# EasyEDA Pro project ProPrj_Trumpet_2025-12-14.epro

# Schematic Schematic1
Board Name: Board1; Create Date: 2025-12-04; Page Name: P1; Project Name: Trumpet; Schematic Name: Schematic1; Update Date: 2025-12-07; Company: EasyEDA.com; Page Size: A4; Version: V1.0
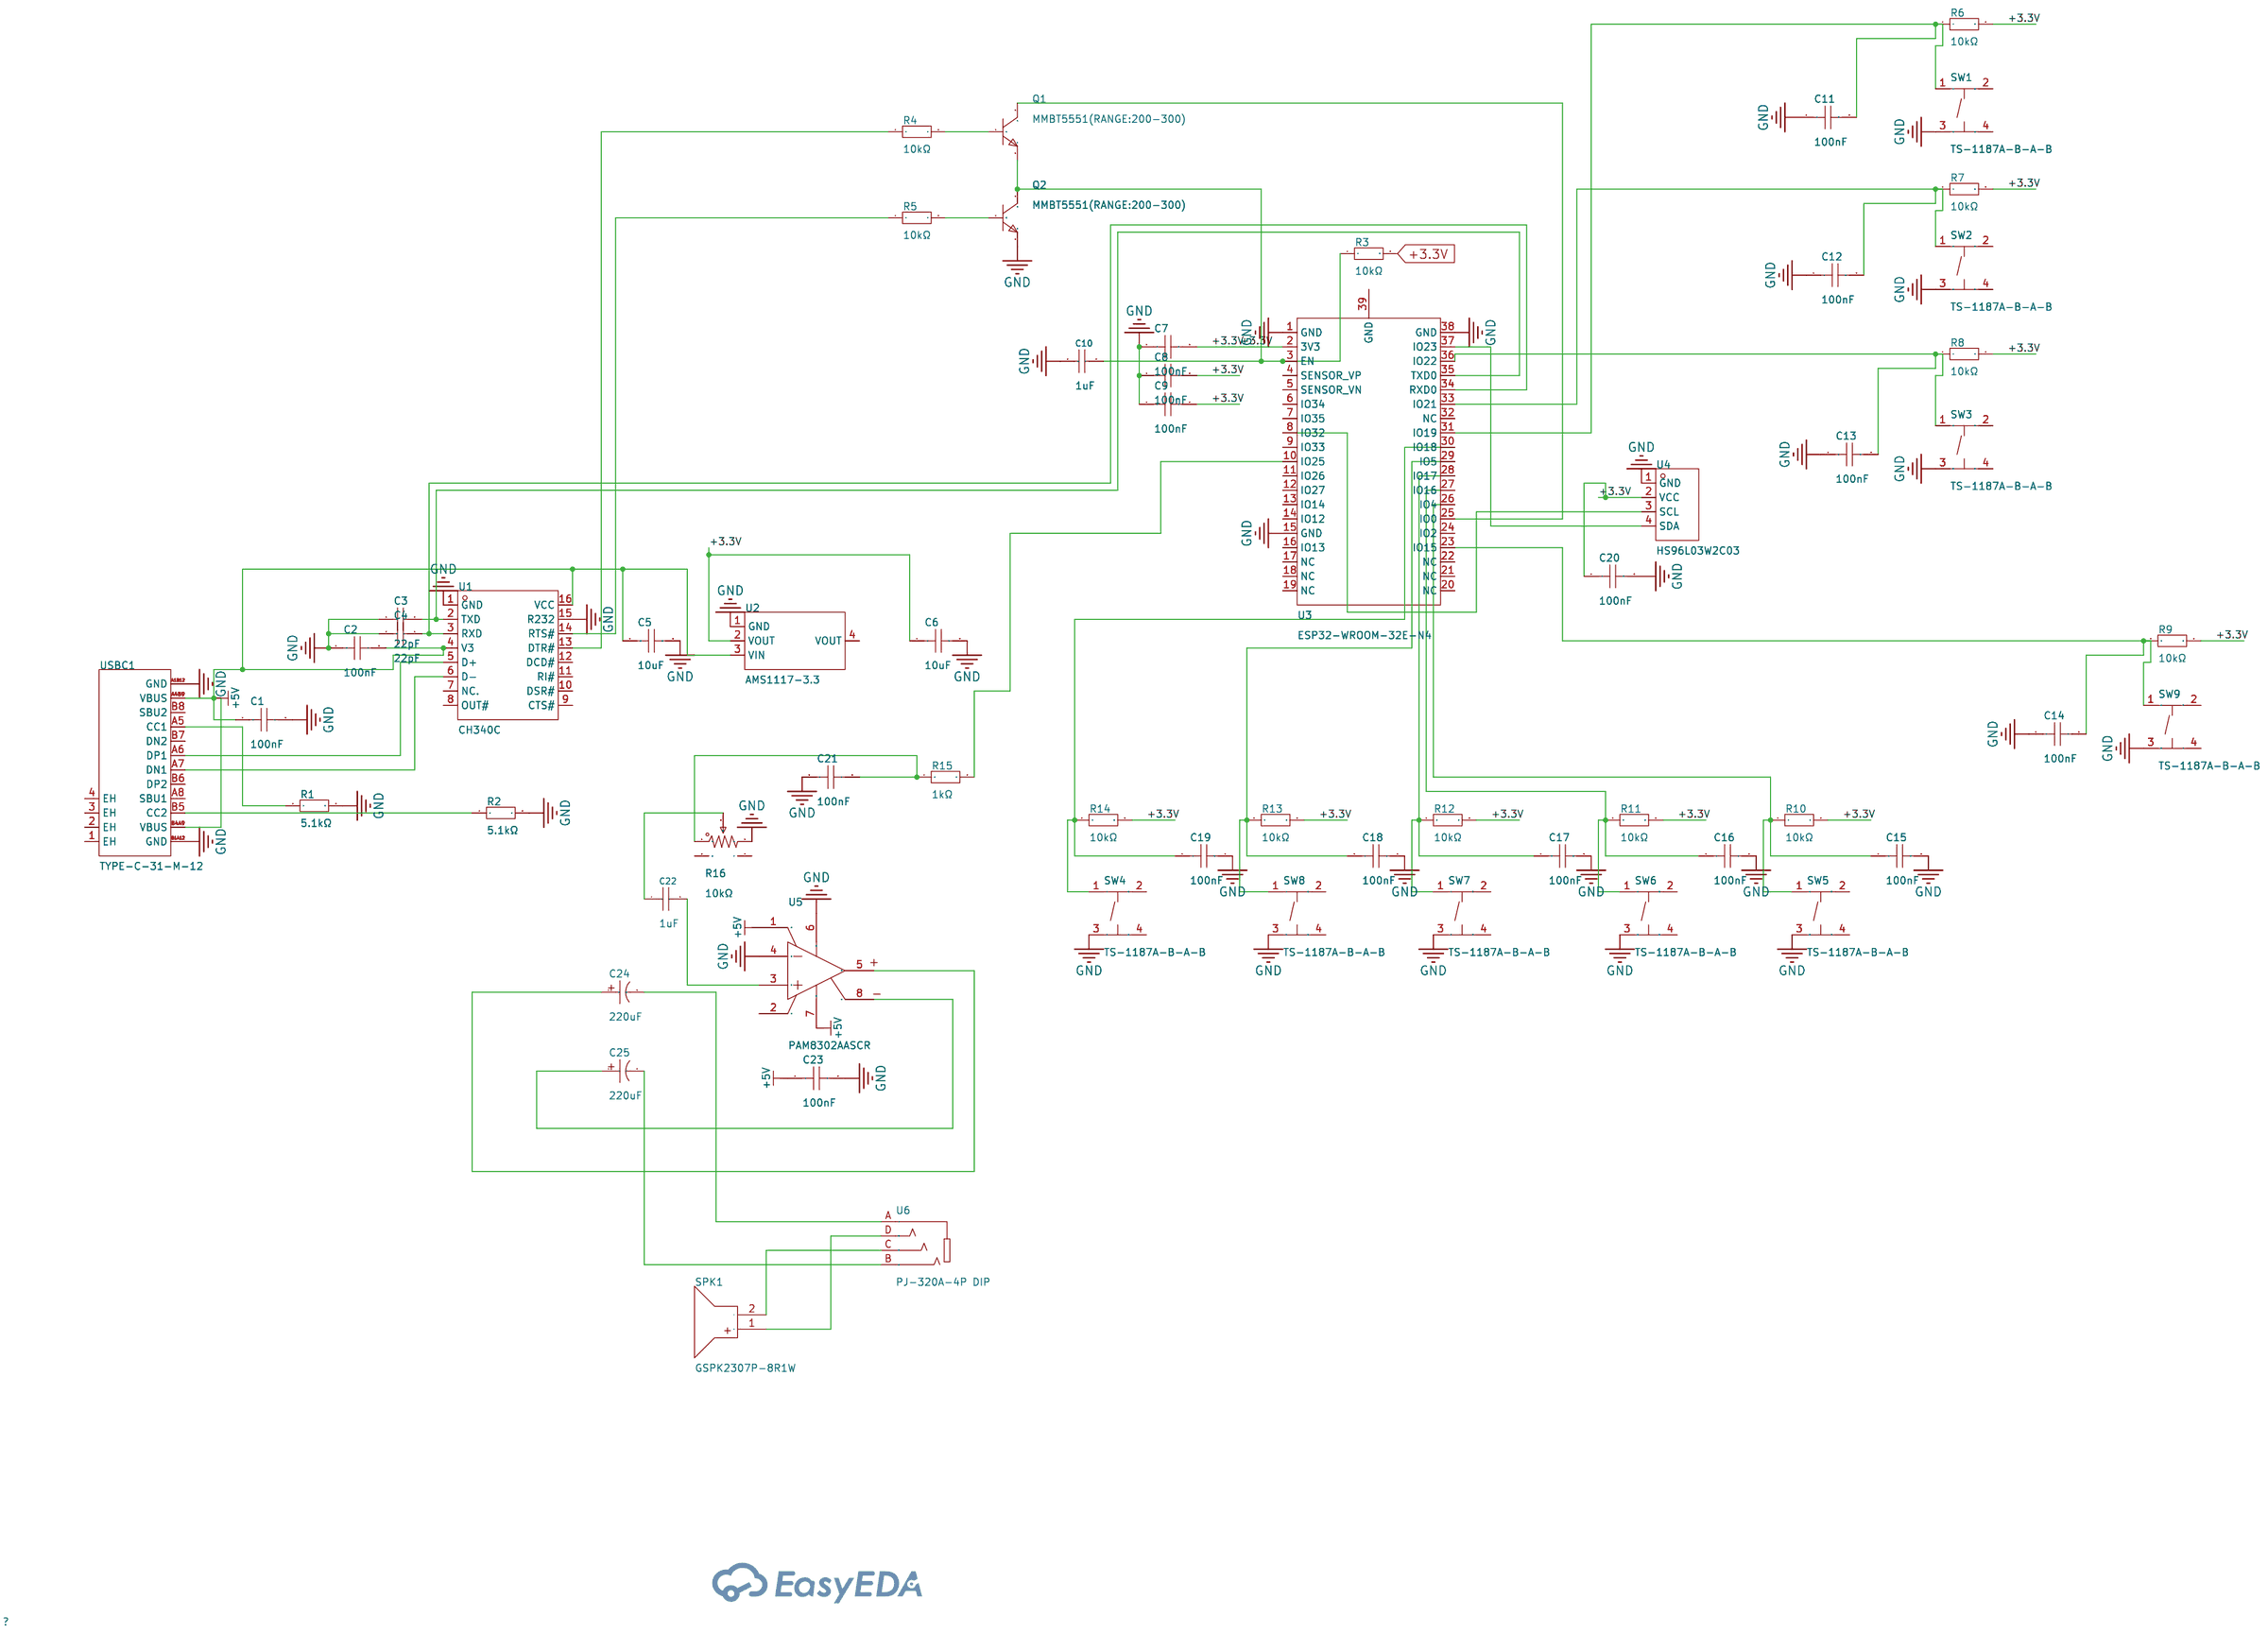
[diagram p0: schematic sheet]

## Parts
C1  100nF  [C0805]
C2  100nF  [C0805]
C3  22pF  [C0402]
C4  22pF  [C0402]
C5  10uF  [C0805]
C6  10uF  [C0805]
C7  100nF  [C0805]
C8  100nF  [C0805]
C9  100nF  [C0805]
C10  1uF  [C0805]
C11  100nF  [C0805]
C12  100nF  [C0805]
C13  100nF  [C0805]
C14  100nF  [C0805]
C15  100nF  [C0805]
C16  100nF  [C0805]
C17  100nF  [C0805]
C18  100nF  [C0805]
C19  100nF  [C0805]
C20  100nF  [C0805]
C21  100nF  [C0805]
C22  1uF  [C0805]
C23  100nF  [C0805]
C24  220uF  [CAP-TH_BD6.3-P2.50-D1.0-FD]
C25  220uF  [CAP-TH_BD6.3-P2.50-D1.0-FD]
Q1  MMBT5551(RANGE:200-300)  [SOT-23-3_L2.9-W1.3-P1.90-LS2.4-BR]
Q2  MMBT5551(RANGE:200-300)  [SOT-23-3_L2.9-W1.3-P1.90-LS2.4-BR]
R1  5.1kΩ  [R0805]
R2  5.1kΩ  [R0805]
R3  10kΩ  [R0805]
R4  10kΩ  [R0805]
R5  10kΩ  [R0805]
R6  10kΩ  [R0805]
R7  10kΩ  [R0805]
R8  10kΩ  [R0805]
R9  10kΩ  [R0805]
R10  10kΩ  [R0805]
R11  10kΩ  [R0805]
R12  10kΩ  [R0805]
R13  10kΩ  [R0805]
R14  10kΩ  [R0805]
R15  1kΩ  [R0805]
R16  10kΩ  [RES-ADJ-TH_RK09L1140A5P]
SPK1  GSPK2307P-8R1W  [SPK-TH_BD23.0-P10.00-D0.8-L-RD]
SW1  TS-1187A-B-A-B  [SW-SMD_4P-L5.1-W5.1-P3.70-LS6.5-TL_H1.5]
SW2  TS-1187A-B-A-B  [SW-SMD_4P-L5.1-W5.1-P3.70-LS6.5-TL_H1.5]
SW3  TS-1187A-B-A-B  [SW-SMD_4P-L5.1-W5.1-P3.70-LS6.5-TL_H1.5]
SW4  TS-1187A-B-A-B  [SW-SMD_4P-L5.1-W5.1-P3.70-LS6.5-TL_H1.5]
SW5  TS-1187A-B-A-B  [SW-SMD_4P-L5.1-W5.1-P3.70-LS6.5-TL_H1.5]
SW6  TS-1187A-B-A-B  [SW-SMD_4P-L5.1-W5.1-P3.70-LS6.5-TL_H1.5]
SW7  TS-1187A-B-A-B  [SW-SMD_4P-L5.1-W5.1-P3.70-LS6.5-TL_H1.5]
SW8  TS-1187A-B-A-B  [SW-SMD_4P-L5.1-W5.1-P3.70-LS6.5-TL_H1.5]
SW9  TS-1187A-B-A-B  [SW-SMD_4P-L5.1-W5.1-P3.70-LS6.5-TL_H1.5]
U1  CH340C  [SOP-16_L10.0-W3.9-P1.27-LS6.0-BL]
U2  AMS1117-3.3  [SOT-223-3_L6.5-W3.4-P2.30-LS7.0-BR]
U3  ESP32-WROOM-32E-N4  [WIFI-SMD_ESP32-WROOM-32E]
U4  HS96L03W2C03  [OLED-TH_L27.8-W27.2-P2.54_C9900033791]
U5  PAM8302AASCR  [MSOP-8_L3.0-W3.0-P0.65-LS5.0-BL]
U6  PJ-320A-4P DIP  [AUDIO-TH_PJ-320A-4P-DIP]
USBC1  TYPE-C-31-M-12  [USB-C_SMD-TYPE-C-31-M-12_1]

## Library data of the parts
C1 C2 C7-C9 C11-C21 C23 = CC0805KRX7R9BB104: Capacitance:100nF Tolerance:±10% Tolerance:±10% Voltage Rating:50V Temperature Coefficient:X7R; LCSC Part Name: 100nF ±10% 50V; Supplier Part: C49678; Manufacturer: YAGEO(国巨); Supplier Footprint: 0805; JLCPCB Part Class: Basic Part; Datasheet: https://item.szlcsc.com/datasheet/CC0805KRX7R9BB104/50686.html; Supplier: LCSC; Tolerance: ±10%; Voltage Rating: 50V; Temperature Coefficient: X7R
C3 C4 = 0402CG220J500NT: Capacitance: Tolerance:±5% Tolerance:±5% Voltage Rated: Temperature Coefficient:; LCSC Part Name: 22pF ±5% 50V; Supplier Part: C1555; Manufacturer: FH(风华); Supplier Footprint: 0402; JLCPCB Part Class: Basic Part; Datasheet: https://atta.szlcsc.com/upload/public/pdf/source/20200305/C486355_26A10D38EF8C2A5C37091D0039909270.pdf; Supplier: LCSC; Tolerance: ±5%
C5 C6 = CL21A106KAYNNNE_C15850: Capacitance:10uF Tolerance:±10% Tolerance:±10% Voltage Rating:25V Temperature Coefficient:X5R; LCSC Part Name: 10uF ±10% 25V; Supplier Part: C15850; Manufacturer: SAMSUNG(三星); Manufacturer Part: CL21A106KAYNNNE; Supplier Footprint: 0805; JLCPCB Part Class: Basic Part; Datasheet: https://item.szlcsc.com/datasheet/CL21A106KAYNNNE/16532.html; Supplier: LCSC; Tolerance: ±10%; Voltage Rating: 25V; Temperature Coefficient: X5R
C10 C22 = CL21B105KBFNNNE: Capacitance:1uF Tolerance:±10% Tolerance:±10% Voltage Rating:50V Temperature Coefficient:X7R; LCSC Part Name: 1uF ±10% 50V; Supplier Part: C28323; Manufacturer: SAMSUNG(三星); Supplier Footprint: 0805; JLCPCB Part Class: Basic Part; Datasheet: https://item.szlcsc.com/datasheet/CL21B105KBFNNNE/29074.html; Supplier: LCSC; Tolerance: ±10%; Voltage Rating: 50V; Temperature Coefficient: X7R
C24 C25 = KM227M016E11RR0VH2FP0: Capacitance:220uF Tolerance:±20% Tolerance:±20% Voltage Rating:16V Ripple Current:- Equivalent Series Resistance(ESR):- Pin Spacing:2.5mm Diameter:6.3mm Height - Seated (Max):11mm Lifetime:1000hrs@105℃; LCSC Part Name: 220uF ±20% 16V; Supplier Part: C43349; Manufacturer: Chengx(承兴); Supplier Footprint: 插件,D6.3xL11mm; JLCPCB Part Class: Extended Part; Datasheet: https://item.szlcsc.com/datasheet/KM227M016E11RR0VH2FP0/44340.html; Supplier: LCSC; Tolerance: ±20%; Voltage Rating: 16V; Pin Spacing: 2.5mm; Diameter: 6.3mm; Height - Seated (Max): 11mm; Lifetime: 1000hrs@105℃
Q1 Q2 = MMBT5551(RANGE:200-300): type:NPN Current - Collector(Ic): Collector - Emitter Voltage VCEO:160V Pd - Power Dissipation:300mW DC Current Gain:200@10mA,5V DC Current Gain:200@10mA,5V Transition frequency(fT):100MHz Current - Collector Cutoff:50nA Vce Saturation(VCE(sat)):150mV Ope; LCSC Part Name: hfe=200~300; Supplier Part: C2145; Manufacturer: CJ(江苏长电/长晶); Supplier Footprint: SOT-23; JLCPCB Part Class: Basic Part; Datasheet: https://atta.szlcsc.com/upload/public/pdf/source/20140321/1457707027001.pdf; Supplier: LCSC; type: NPN; Collector - Emitter Voltage VCEO: 160V; Pd - Power Dissipation: 300mW; DC Current Gain: 200@10mA,5V; Transition frequency(fT): 100MHz; Current - Collector Cutoff: 50nA; Vce Saturation(VCE(sat)): 150mV; Operating Temperature: -55℃~+150℃
R1 R2 = 0805W8F5101T5E: Type:Thick Film Resistor Resistance:5.1kΩ Tolerance:±1% Tolerance:±1% Power(Watts):125mW Voltage-Supply(Max):150V Temperature Coefficient:±100ppm/℃ Temperature Coefficient:±100ppm/℃ Operating Temperature:-55℃~+155℃ Operating Temperature:-55℃~+155℃; LCSC Part Name: 5.1kΩ ±1% 125mW 厚膜电阻; Supplier Part: C27834; Manufacturer: UNI-ROYAL(厚声); Supplier Footprint: 0805; JLCPCB Part Class: Basic Part; Datasheet: https://item.szlcsc.com/datasheet/0805W8F5101T5E/28584.html; Supplier: LCSC; Type: Thick Film Resistor; Tolerance: ±1%; Power(Watts): 125mW; Voltage-Supply(Max): 150V; Temperature Coefficient: ±100ppm/℃; Operating Temperature: -55℃~+155℃
R3-R14 = 0805W8F1002T5E: Type:Thick Film Resistor Resistance:10kΩ Tolerance:±1% Tolerance:±1% Power(Watts):125mW Voltage-Supply(Max):150V Temperature Coefficient:±100ppm/℃ Temperature Coefficient:±100ppm/℃ Operating Temperature:-55℃~+155℃ Operating Temperature:-55℃~+155℃; LCSC Part Name: 10kΩ ±1% 125mW 厚膜电阻; Supplier Part: C17414; Manufacturer: UNI-ROYAL(厚声); Supplier Footprint: 0805; JLCPCB Part Class: Basic Part; Datasheet: https://item.szlcsc.com/datasheet/0805W8F1002T5E/18102.html; Supplier: LCSC; Type: Thick Film Resistor; Tolerance: ±1%; Power(Watts): 125mW; Voltage-Supply(Max): 150V; Temperature Coefficient: ±100ppm/℃; Operating Temperature: -55℃~+155℃
R15 = 0805W8F1001T5E: Type:Thick Film Resistors Resistance:1kΩ Tolerance:±1% Tolerance:±1% Power(Watts): Overload Voltage (Max): Temperature Coefficient:±100ppm/℃ Temperature Coefficient:±100ppm/℃ Operating Temperature Range:-55℃~+155℃ Operating Temperature Range:-55℃~+155℃; LCSC Part Name: 1kΩ ±1% 125mW 厚膜电阻; Supplier Part: C17513; Manufacturer: UNI-ROYAL(厚声); Supplier Footprint: 0805; JLCPCB Part Class: Basic Part; Datasheet: https://atta.szlcsc.com/upload/public/pdf/source/20200306/C422600_1E6D84923E4A46A82E41ADD87F860B5C.pdf; Supplier: LCSC; Type: Thick Film Resistors; Tolerance: ±1%; Temperature Coefficient: ±100ppm/℃; Operating Temperature Range: -55℃~+155℃
R16 = RK09L114001T: Resistance: Tolerance:±20% Tolerance:±20% Rated Voltage: Power(Watts):50mW Turns:-; LCSC Part Name: 10kΩ ±20%; Supplier Part: C470463; Manufacturer: ALPSALPINE(阿尔卑斯阿尔派); Supplier Footprint: 插件; JLCPCB Part Class: Extended Part; Datasheet: https://atta.szlcsc.com/upload/public/pdf/source/20191216/C470489_E36F9C6EE0CCD2AF3E5C837DE947D32B.pdf; Supplier: LCSC; Tolerance: ±20%; Power(Watts): 50mW
SPK1 = GSPK2307P-8R1W: Technology:Electromagnetic Impedance:8Ω Resonant Frequency:1.7kHz Total Harmonic Distortion(THD):5% Total Harmonic Distortion(THD):5% Rated Power:500mW Sound Pressure Level(SPL):88dB Diameter(φD):23mm Height:6.8mm Operating Temperature:-40℃~+85℃ Operating; LCSC Part Name: 23mm 8Ω; Supplier Part: C530531; Manufacturer: INGHAi(赢海); JLCPCB Part Class: Extended Part; Datasheet: https://item.szlcsc.com/datasheet/GSPK2307P-8R1W/550865.html; Supplier: LCSC; Technology: Electromagnetic; Impedance: 8Ω; Resonant Frequency: 1.7kHz; Total Harmonic Distortion(THD): 5%; Rated Power: 500mW; Sound Pressure Level(SPL): 88dB; Diameter(φD): 23mm; Height: 6.8mm; Operating Temperature: -40℃~+85℃
SW1-SW9 = TS-1187A-B-A-B: Circuit:SPST Actuator Style:Round Button Operating Force:1.6N Mounting Type:Surface Mount,Vertical Length:5.1mm Width:5.1mm Switch Height:1.5mm with Bracket:Without Bracket Contact Current:50mA Voltage Rating:12V Actuator/Cap Color:Gold With Lamp:No Life:; LCSC Part Name: 5.1*5.1*1.5mm 立贴 轻触开关; Supplier Part: C318884; Manufacturer: XKB Connection(中国星坤); Supplier Footprint: SMD; JLCPCB Part Class: Basic Part; Datasheet: https://item.szlcsc.com/datasheet/TS-1187A-B-A-B/299976.html; Supplier: LCSC; Circuit: SPST; Actuator Style: Round Button; Operating Force: 1.6N; Mounting Type: Surface Mount,Vertical; Length: 5.1mm; Width: 5.1mm; Switch Height: 1.5mm; with Bracket: Without Bracket; Contact Current: 50mA; Voltage Rating: 12V; Actuator/Cap Color: Gold; With Lamp: No; Life: 100,000 Cycles; Operating Temperature: -30℃~+85℃
U1 = CH340C: Applications Function:Transceiver USB Protocol:USB 2.0 Voltage - Supply:3.3V；5V Voltage - Supply:3.3V；5V Data Rate:2Mbps Operating Temperature:-20℃~+70℃ Operating Temperature:-20℃~+70℃ Current - Supply:7mA Supply Current (Iq):50uA; LCSC Part Name: USB转串口芯片; Supplier Part: C84681; Manufacturer: WCH(南京沁恒); Supplier Footprint: SOP-16; JLCPCB Part Class: Extended Part; Datasheet: https://item.szlcsc.com/datasheet/CH340C/85852.html; Supplier: LCSC; Applications Function: Transceiver; USB Protocol: USB 2.0; Voltage - Supply: 3.3V；5V; Data Rate: 2Mbps; Operating Temperature: -20℃~+70℃; Current - Supply: 7mA; Supply Current (Iq): 50uA
U2 = AMS1117-3.3_C6186: Output Type:Fixed Voltage - Supply:16V Output Voltage:3.3V Output Voltage:3.3V Output Current:1A Power Supply Rejection Ratio (PSRR):72dB@(120Hz) Voltage Dropout:1.1V@(800mA) standby current:5mA Noise:0.003%Vout Features:Over Current Protection；Over Tempe; LCSC Part Name: 输出3.3V 1A; Supplier Part: C6186; Manufacturer: AMS; Supplier Footprint: SOT-223; JLCPCB Part Class: Basic Part; Datasheet: https://item.szlcsc.com/datasheet/AMS1117-3.3/6652.html; Supplier: LCSC; Output Type: Fixed; Voltage - Supply: 16V; Output Voltage: 3.3V; Output Current: 1A; Power Supply Rejection Ratio (PSRR): 72dB@(120Hz); Voltage Dropout: 1.1V@(800mA); standby current: 5mA; Noise: 0.003%Vout; Features: Over Current Protection；Over Temperature Protection; Operating Temperature: -40℃~+125℃; Output Configuration: Positive; Number of Outputs: 1
U3 = ESP32-WROOM-32E-N4: LCSC Part Name: 通用型Wi-Fi+BT+BLE MCU模组; Supplier Part: C701341; Manufacturer: ESPRESSIF(乐鑫); Supplier Footprint: SMD,25.5x18mm; JLCPCB Part Class: Extended Part; Datasheet: https://item.szlcsc.com/datasheet/ESP32-WROOM-32E-N4/736349.html; Supplier: LCSC
U4 = HS96L03W2C03: Main Control Chip:SSD1315 Interface Type:I2C Size:0.96 Pixel Resolution:128x64 Operating Temperature:-40℃~+70℃ Operating Temperature:-40℃~+70℃; LCSC Part Name: 0.96寸OLED显示屏窄白光IIC; Supplier Part: C5248080; Manufacturer: HS(汉昇); JLCPCB Part Class: Extended Part; Datasheet: https://atta.szlcsc.com/upload/public/pdf/source/20230627/763D01F79A90007632F098068C7C8AD9.pdf; Supplier: LCSC; Main Control Chip: SSD1315; Interface Type: I2C; Size: 0.96; Pixel Resolution: 128x64; Operating Temperature: -40℃~+70℃
U5 = PAM8302AASCR: Class:Class D Speaker Channels:1-Channel Output Power:2.5Wx1@4Ω Voltage - Supply:2V~5.5V Voltage - Supply:2V~5.5V Total Harmonic Distortion + Noise (THD+N):0.3% Quiescent Current:4mA Operating Temperature:-40℃~+85℃ Operating Temperature:-40℃~+85℃ Signal-t; LCSC Part Name: 2.5W单声道D类音频功率放大器; Supplier Part: C113367; Manufacturer: DIODES(美台); Supplier Footprint: MSOP-8; JLCPCB Part Class: Extended Part; Datasheet: https://item.szlcsc.com/datasheet/PAM8302AASCR/114602.html; Supplier: LCSC; Class: Class D; Speaker Channels: 1-Channel; Output Power: 2.5Wx1@4Ω; Voltage - Supply: 2V~5.5V; Total Harmonic Distortion + Noise (THD+N): 0.3%; Quiescent Current: 4mA; Operating Temperature: -40℃~+85℃; Signal-to-Noise Ratio: 80dB; Power Supply Rejection Ratio (PSRR): 50dB; Efficiency: 85%
U6 = PJ-320A-4P DIP: Connector Type:3.5mm Headphone Jack Current Rating:500mA Voltage Rating (Max):30V Contact Material:- Contact Plating:Silver Operating Temperature:-20℃~+80℃ Operating Temperature:-20℃~+80℃; LCSC Part Name: 3.5mm耳机座; Supplier Part: C18185602; Manufacturer: SHOU HAN(首韩); Supplier Footprint: 插件; JLCPCB Part Class: Extended Part; Datasheet: https://item.szlcsc.com/datasheet/PJ-320A-4P%2520DIP/19332232.html; Supplier: LCSC; Connector Type: 3.5mm Headphone Jack; Current Rating: 500mA; Voltage Rating (Max): 30V; Contact Plating: Silver; Operating Temperature: -20℃~+80℃
USBC1 = TYPE-C-31-M-12: Connector Type:Type-C Protocol Standard:- Gender:Female Mounting Type:- Number of Contacts:16P Number of Ports:1 Current Rating-Power:5A Operating Temperature:- Operating Temperature:-; LCSC Part Name: Type-C 母; Supplier Part: C165948; Manufacturer: 韩国韩荣; Supplier Footprint: SMD; JLCPCB Part Class: Extended Part; Datasheet: https://item.szlcsc.com/datasheet/TYPE-C-31-M-12/177331.html; Supplier: LCSC; Connector Type: Type-C; Gender: Female; Number of Contacts: 16P; Number of Ports: 1; Current Rating-Power: 5A

## Nets
+3.3V: C6.1 C7.2 C8.2 C9.2 C20.1 R3.2 R6.2 R7.2 R8.2 R9.2 R10.2 R11.2 R12.2 R13.2 R14.2 U2.2(VOUT) U3.2(3V3) U4.2(VCC)
+5V: C1.1 C2.2 C5.1 C23.1 U1.4(V3) U1.16(VCC) U2.3(VIN) U5.1(SD#) U5.7(GND) USBC1.A4B9(VBUS) USBC1.B4A9(VBUS)
GND: C1.2 C2.1 C3.1 C4.1 C5.2 C6.2 C7.1 C8.1 C9.1 C10.1 C11.1 C12.1 C13.1 C14.1 C15.2 C16.2 C17.2 C18.2 C19.2 C20.2 C21.1 C23.2 Q2.2(E) R1.2 R2.2 R16.3 SW1.3(C) SW2.3(C) SW3.3(C) SW4.3(C) SW5.3(C) SW6.3(C) SW7.3(C) SW8.3(C) SW9.3(C) U1.1(GND) U1.15(R232) U2.1(GND) U3.1(GND) U3.15(GND) U3.38(GND) U4.1(GND) U5.4(IN-) U5.6(VDD) USBC1.A1B12(GND) USBC1.B1A12(GND)
$1N14651: U1.5(D+) USBC1.A6(DP1)
$1N14657: U1.6(D-) USBC1.A7(DN1)
$1N14664: R1.1 USBC1.A5(CC1)
$1N14674: R2.1 USBC1.B5(CC2)
$1N14925: C3.2 U1.2(TXD) U3.35(TXD0)
$1N14929: C4.2 U1.3(RXD) U3.34(RXD0)
$1N16150: C10.2 Q1.2(E) Q2.3(C) R3.1 U3.3(EN)
$1N16384: R4.1 U1.13(DTR#)
$1N16390: Q1.1(B) R4.2
$1N16433: Q1.3(C) U3.25(IO0)
$1N16439: R5.1 U1.14(RTS#)
$1N16446: Q2.1(B) R5.2
$1N17964: C11.2 R6.1 SW1.1(A) U3.31(IO19)
$1N17970: C12.2 R7.1 SW2.1(A) U3.33(IO21)
$1N17977: C13.2 R8.1 SW3.1(A) U3.36(IO22)
$1N17983: C19.1 R14.1 SW4.1(A) U3.30(IO18)
$1N17990: C18.1 R13.1 SW8.1(A) U3.29(IO5)
$1N17997: C17.1 R12.1 SW7.1(A) U3.28(IO17)
$1N18003: C16.1 R11.1 SW6.1(A) U3.27(IO16)
$1N18034: C15.1 R10.1 SW5.1(A) U3.26(IO4)
$1N18049: C14.2 R9.1 SW9.1(A) U3.23(IO15)
$1N18923: U3.37(IO23) U4.4(SDA)
$1N18929: U3.8(IO32) U4.3(SCL)
$1N19540: R15.2 U3.10(IO25)
$1N19549: C21.2 R15.1 R16.1
$1N19616: C22.1 R16.2
$1N19621: C22.2 U5.3(IN+)
$1N19795: C24.1 U5.5(VO+)
$1N19810: C25.1 U5.8(VO-)
$1N19936: C25.2 U6.B
$1N19941: C24.2 U6.A
$1N19948: SPK1.1(+) U6.D
$1N19955: SPK1.2(-) U6.C

Not connected (* = marked no-connect by the designer): R16 4 5; SW1 2(B) 4(D); SW2 2(B) 4(D); SW3 2(B) 4(D); SW4 2(B) 4(D); SW5 2(B) 4(D); SW6 2(B) 4(D); SW7 2(B) 4(D); SW8 2(B) 4(D); SW9 2(B) 4(D); U1 7(NC.) 8(OUT#) 9(CTS#) 10(DSR#) 11(RI#) 12(DCD#); U2 4(VOUT); U3 4(SENSOR_VP) 5(SENSOR_VN) 6(IO34) 7(IO35) 9(IO33) 11(IO26) 12(IO27) 13(IO14) 14(IO12) 16(IO13) 17(NC) 18(NC) 19(NC) 20(NC) 21(NC) 22(NC) 24(IO2) 32(NC) 39(GND); U5 2(NC); USBC1 1(EH) 2(EH) 3(EH) 4(EH) A8(SBU1) B6(DP2) B7(DN2) B8(SBU2)

# Board PCB1
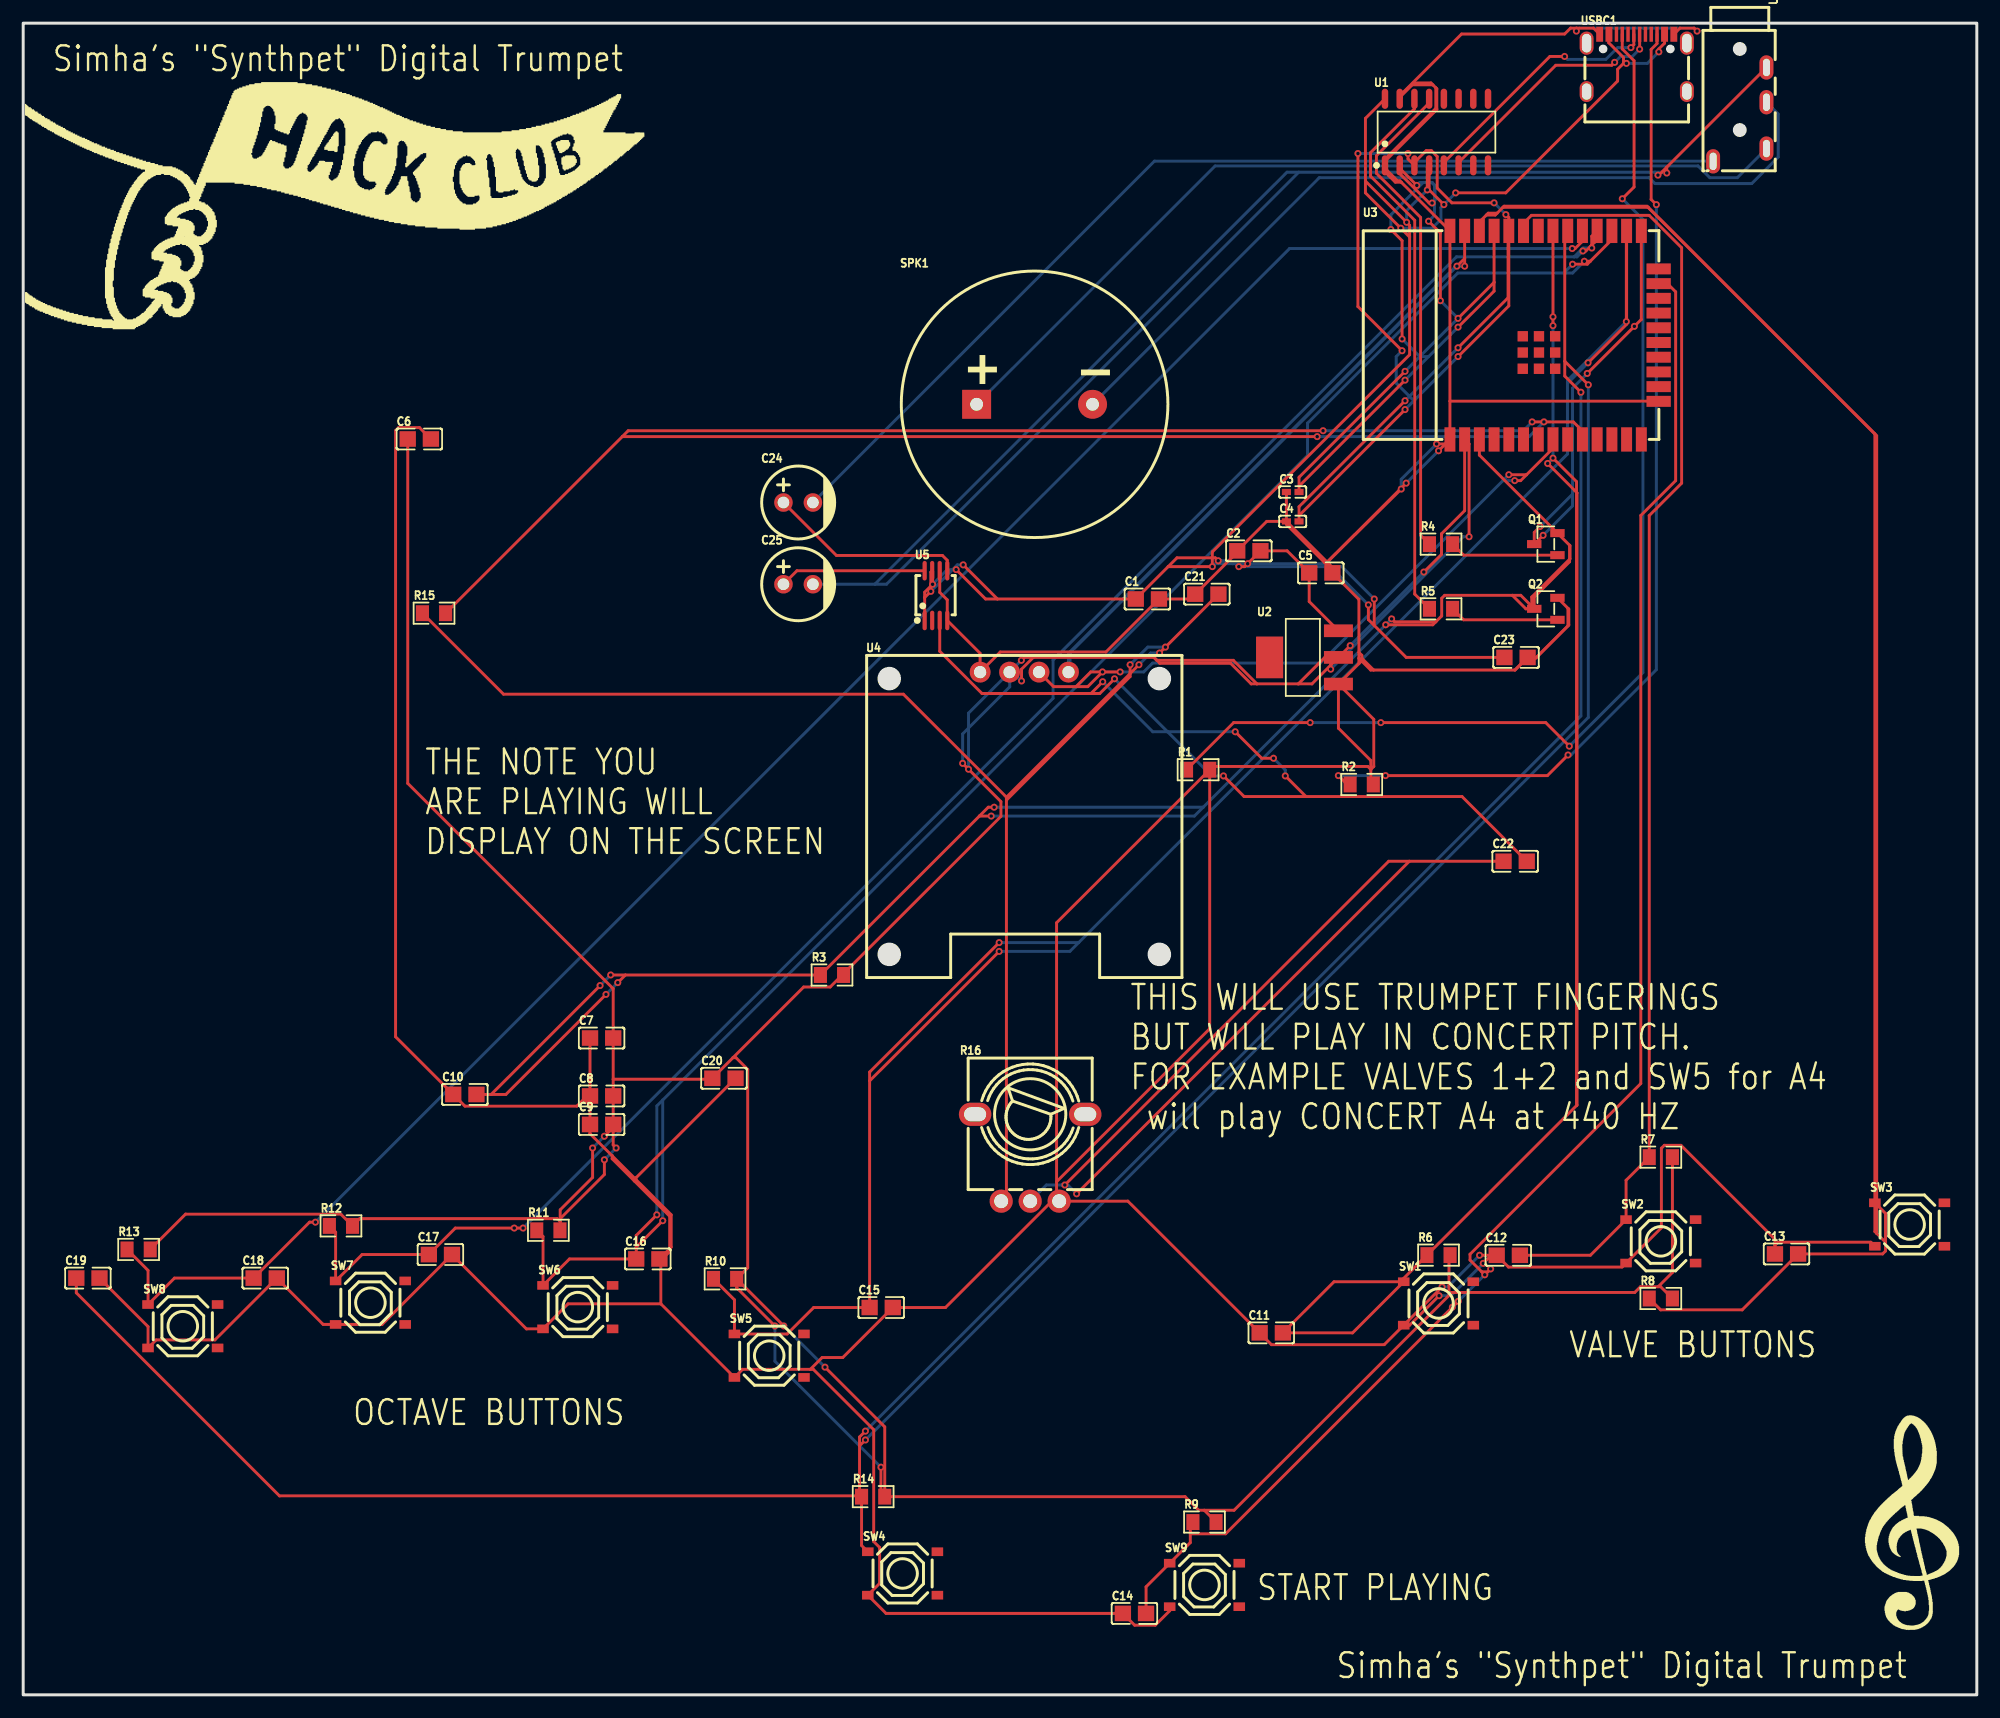
[diagram p1: board, top side]
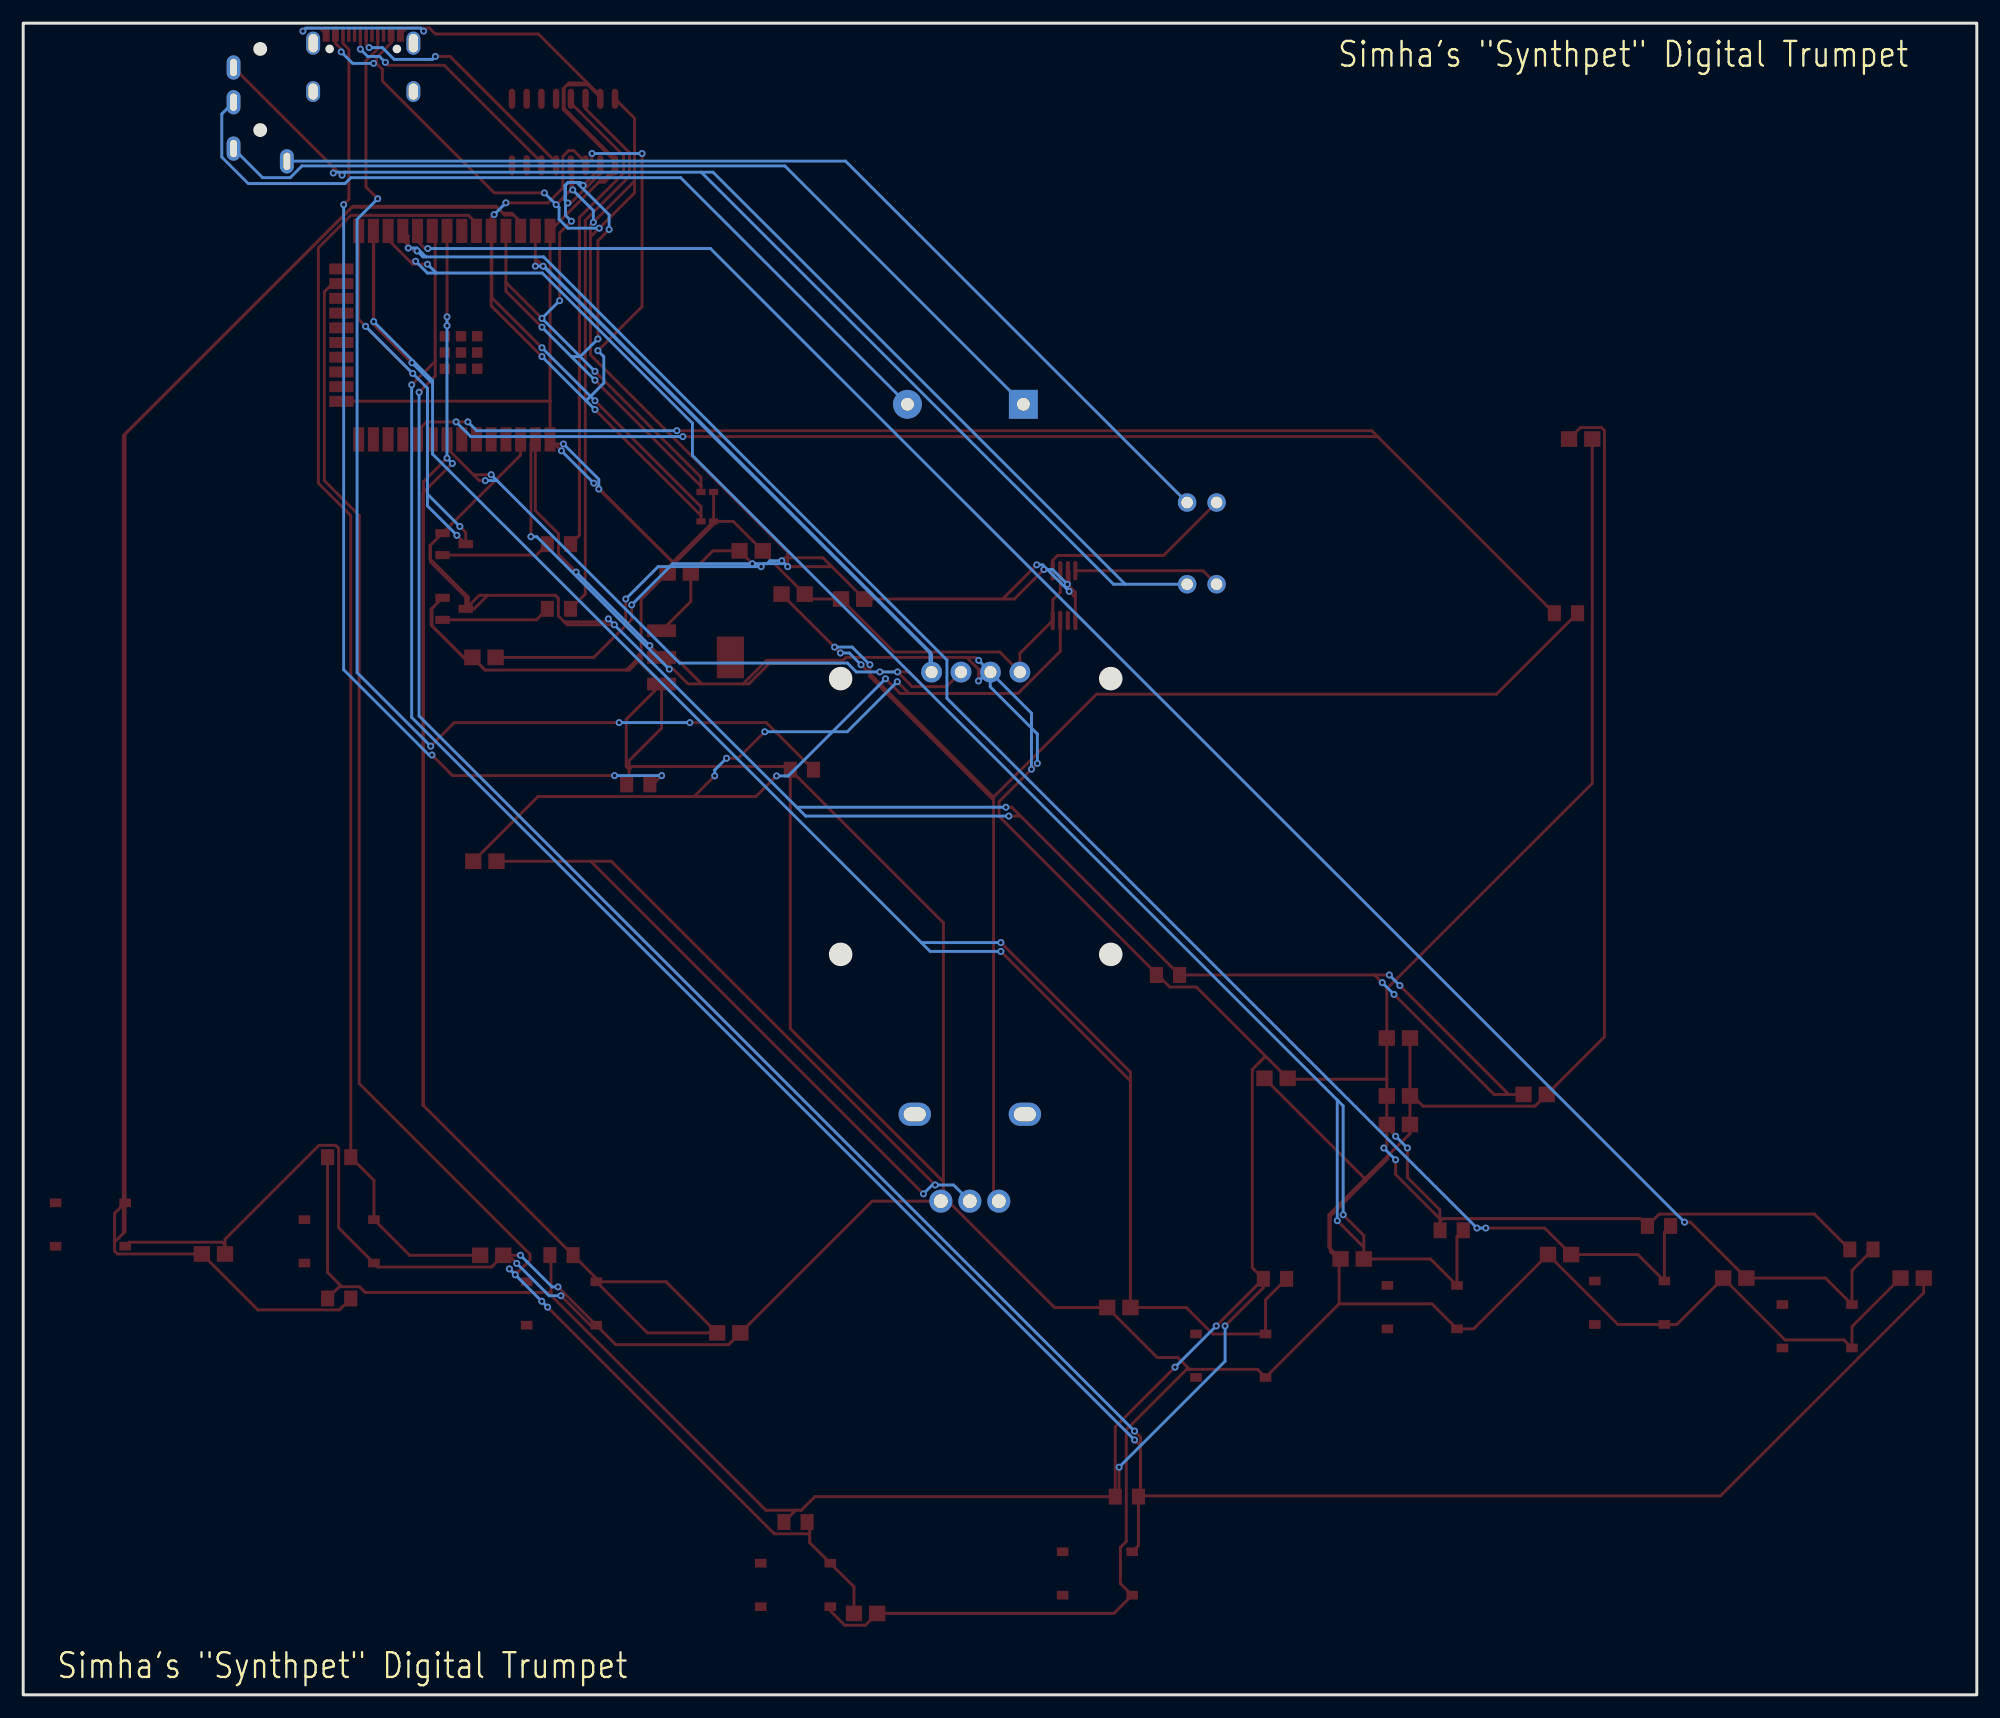
[diagram p2: board, bottom side, seen from below]

Outline 168.53 x 144.27 mm; copper layers: Top Layer, Bottom Layer. Coordinates in mm from the lower left corner of the outline.
Outline path: rectangle 0,144.27 168.53,0
Stack: Top Layer 0.035mm / Dielectric1 1.51mm FR4 er 4.5 / Bottom Layer 0.035mm

## Design rules (mm)
template: JLCPCB Capability(Two Layers Board)
spacing copperThickness1oz (default): track to track 0.102, other pairs 0.152 to 0.3
spacing copperThickness2oz: track to track 0.203, other pairs 0.152 to 0.3
track width copperThickness1oz (default): min 0.127, default 0.254, max 2.54
track width copperThickness2oz: min 0.203, default 0.254, max 2.54
differential pair differentialPair (default): width min 0.127, default 0.254, max 2.54; gap min 0.152, default 0.152
via viaSize (default): diameter min 0.5, default 0.61, max 10; hole min 0.3, default 0.305, max 6.3

## Placement (name value [footprint] x y rotation side)
C1  100nF  [C0805]  96.98 94.57 0 top
C2  100nF  [C0805]  105.73 98.73 0 top
C3  22pF  [C0402]  109.52 103.81 0 top
C4  22pF  [C0402]  109.52 101.27 0 top
C5  10uF  [C0805]  111.94 96.83 0 top
C6  10uF  [C0805]  34.17 108.38 0 top
C7  100nF  [C0805]  49.9 56.69 0 top
C8  100nF  [C0805]  49.9 51.69 0 top
C9  100nF  [C0805]  49.9 49.23 0 top
C10  1uF  [C0805]  38.1 51.82 0 top
C11  100nF  [C0805]  107.66 31.24 0 top
C12  100nF  [C0805]  128.11 37.94 0 top
C13  100nF  [C0805]  152.11 38.05 0 top
C14  100nF  [C0805]  95.86 7.03 0 top
C15  100nF  [C0805]  74.02 33.43 0 top
C16  100nF  [C0805]  53.88 37.62 0 top
C17  100nF  [C0805]  35.99 38 0 top
C18  100nF  [C0805]  20.88 35.97 0 top
C19  100nF  [C0805]  5.58 35.97 0 top
C20  100nF  [C0805]  60.45 53.21 0 top
C21  100nF  [C0805]  102.11 95 0 top
C22  1uF  [C0805]  128.7 71.94 0 top
C23  100nF  [C0805]  128.78 89.53 0 top
C24  220uF  [CAP-TH_BD6.3-P2.50-D1.0-FD]  66.85 102.9 0 top
C25  220uF  [CAP-TH_BD6.3-P2.50-D1.0-FD]  66.85 95.85 0 top
Q1  MMBT5551(RANGE:200-300)  [SOT-23-3_L2.9-W1.3-P1.90-LS2.4-BR]  131.35 99.31 0 top
Q2  MMBT5551(RANGE:200-300)  [SOT-23-3_L2.9-W1.3-P1.90-LS2.4-BR]  131.35 93.73 0 top
R1  5.1kΩ  [R0805]  101.35 79.84 0 top
R2  5.1kΩ  [R0805]  115.47 78.57 0 top
R3  10kΩ  [R0805]  69.77 62.13 0 top
R4  10kΩ  [R0805]  122.31 99.31 0 top
R5  10kΩ  [R0805]  122.31 93.73 0 top
R6  10kΩ  [R0805]  122.09 37.95 0 top
R7  10kΩ  [R0805]  141.27 46.4 0 top
R8  10kΩ  [R0805]  141.27 34.21 0 top
R9  10kΩ  [R0805]  101.9 14.91 0 top
R10  10kΩ  [R0805]  60.55 35.9 0 top
R11  10kΩ  [R0805]  45.3 40.09 0 top
R12  10kΩ  [R0805]  27.41 40.47 0 top
R13  10kΩ  [R0805]  9.96 38.44 0 top
R14  10kΩ  [R0805]  73.32 17.1 0 top
R15  1kΩ  [R0805]  35.44 93.35 0 top
R16  10kΩ  [RES-ADJ-TH_RK09L1140A5P]  86.87 46.35 0 top
SPK1  GSPK2307P-8R1W  [SPK-TH_BD23.0-P10.00-D0.8-L-RD]  87.25 111.38 0 top
SW1  TS-1187A-B-A-B  [SW-SMD_4P-L5.1-W5.1-P3.70-LS6.5-TL_H1.5]  122.09 33.78 0 top
SW2  TS-1187A-B-A-B  [SW-SMD_4P-L5.1-W5.1-P3.70-LS6.5-TL_H1.5]  141.27 39.14 0 top
SW3  TS-1187A-B-A-B  [SW-SMD_4P-L5.1-W5.1-P3.70-LS6.5-TL_H1.5]  162.73 40.59 0 top
SW4  TS-1187A-B-A-B  [SW-SMD_4P-L5.1-W5.1-P3.70-LS6.5-TL_H1.5]  75.86 10.47 0 top
SW5  TS-1187A-B-A-B  [SW-SMD_4P-L5.1-W5.1-P3.70-LS6.5-TL_H1.5]  64.36 29.27 0 top
SW6  TS-1187A-B-A-B  [SW-SMD_4P-L5.1-W5.1-P3.70-LS6.5-TL_H1.5]  47.84 33.46 0 top
SW7  TS-1187A-B-A-B  [SW-SMD_4P-L5.1-W5.1-P3.70-LS6.5-TL_H1.5]  29.95 33.84 0 top
SW8  TS-1187A-B-A-B  [SW-SMD_4P-L5.1-W5.1-P3.70-LS6.5-TL_H1.5]  13.77 31.81 0 top
SW9  TS-1187A-B-A-B  [SW-SMD_4P-L5.1-W5.1-P3.70-LS6.5-TL_H1.5]  101.9 9.48 0 top
U1  CH340C  [SOP-16_L10.0-W3.9-P1.27-LS6.0-BL]  121.92 134.87 0 top
U2  AMS1117-3.3  [SOT-223-3_L6.5-W3.4-P2.30-LS7.0-BR]  110.49 89.53 0 top
U3  ESP32-WROOM-32E-N4  [WIFI-SMD_ESP32-WROOM-32E]  132.08 117.35 0 top
U4  HS96L03W2C03  [OLED-TH_L27.8-W27.2-P2.54_C9900033791]  86.36 88.27 0 top
U5  PAM8302AASCR  [MSOP-8_L3.0-W3.0-P0.65-LS5.0-BL]  78.74 94.87 0 top
U6  PJ-320A-4P DIP  [AUDIO-TH_PJ-320A-4P-DIP]  148.08 136.4 270 top
USBC1  TYPE-C-31-M-12  [USB-C_SMD-TYPE-C-31-M-12_1]  139.19 140.84 0 top

## Footprints (pads in the part's own frame, mm; a bottom-side part is the same pattern mirrored in y, then rotated)
AUDIO-TH_PJ-320A-4P-DIP
  oval 2.1x1.2 hole 1.5x0.6: A(4.05,-2.3) B(-4.05,2.3) C(-1.05,2.3) D(2.95,2.3)
C0402
  rect 0.79x0.54 smd: 1(-0.545,0) 2(0.545,0)
C0805
  rect 1.41x1.35 smd: 1(-1,0) 2(1,0)
CAP-TH_BD6.3-P2.50-D1.0-FD
  round 1.6 hole 1: 1(-1.27,0) 2(1.27,0)
MSOP-8_L3.0-W3.0-P0.65-LS5.0-BL
  oval 0.364x1.692 smd: 1(-0.975,-2.146) 2(-0.325,-2.146) 3(0.325,-2.146) 4(0.975,-2.146) 5(0.975,2.146) 6(0.325,2.146) 7(-0.325,2.146) 8(-0.975,2.146)
OLED-TH_L27.8-W27.2-P2.54_C9900033791
  round 1.8 hole 1.05: 1(-3.81,0) 2(-1.27,0) 3(1.27,0) 4(3.81,0)
R0805
  rect 1.133x1.377 smd: 1(-1,0) 2(1,0)
RES-ADJ-TH_RK09L1140A5P
  round 2 hole 1.2: 1(-2.5,-3.75) 2(0,-3.75) 3(2.5,-3.75)
  oval 2.8x2 hole 1.9x1.2: 4(4.75,3.75) 5(-4.75,3.75)
SOP-16_L10.0-W3.9-P1.27-LS6.0-BL
  oval 0.56x1.745 smd: 1(-4.445,-2.873) 2(-3.175,-2.873) 3(-1.905,-2.873) 4(-0.635,-2.873) 5(0.635,-2.873) 6(1.905,-2.873) 7(3.175,-2.873) 8(4.445,-2.873) 9(4.445,2.873) 10(3.175,2.873) 11(1.905,2.873) 12(0.635,2.873) 13(-0.635,2.873) 14(-1.905,2.873) 15(-3.175,2.873) 16(-4.445,2.873)
SOT-23-3_L2.9-W1.3-P1.90-LS2.4-BR
  rect 1.25x0.7 smd: 1(1,-0.95) 2(1,0.95) 3(-1,0)
SOT-223-3_L6.5-W3.4-P2.30-LS7.0-BR
  rect 2.5x1.1 smd: 1(2.97,-2.3) 2(2.97,0) 3(2.97,2.3)
  rect 2.34x3.6 smd: 4(-2.97,0)
SPK-TH_BD23.0-P10.00-D0.8-L-RD
  rect 2.5x2.5 hole 1.1: 1(-5,0)
  round 2.5 hole 1.1: 2(5,0)
SW-SMD_4P-L5.1-W5.1-P3.70-LS6.5-TL_H1.5
  rect 1x0.75 smd: 1(-3,1.875) 2(3,1.875) 3(-3,-1.875) 4(3,-1.875)
USB-C_SMD-TYPE-C-31-M-12_1
  oval 1.2x2 hole 0.8x1.6: 1(4.325,1.706) 4(-4.325,1.706)
  oval 1.2x1.8 hole 0.8x1.4: 2(4.325,-2.474) 3(-4.325,-2.474)
  custom 0.6x1.3 smd: A1B12(-3.2,2.474) A4B9(-2.4,2.474) B1A12(3.2,2.474) B4A9(2.401,2.474)
  rect 0.3x1.3 smd: A5(-1.25,2.474) A6(-0.25,2.474) A7(0.25,2.474) A8(1.25,2.474) B5(1.75,2.474) B6(0.75,2.474) B7(-0.75,2.474) B8(-1.75,2.474)
WIFI-SMD_ESP32-WROOM-32E
  rect 0.95x2.1 smd: 1(-9.002,-9) 2(-7.732,-9) 3(-6.463,-9) 4(-5.192,-9) 5(-3.922,-9) 6(-2.652,-9) 7(-1.383,-9) 8(-0.113,-9) 9(1.157,-9) 10(2.428,-9) 11(3.697,-9) 12(4.968,-9) 13(6.237,-9) 14(7.508,-9) 25(7.508,9) 26(6.237,9) 27(4.968,9) 28(3.697,9) 29(2.428,9) 30(1.157,9) 31(-0.113,9) 32(-1.383,9) 33(-2.652,9) 34(-3.922,9) 35(-5.192,9) 36(-6.463,9) 37(-7.732,9) 38(-9.002,9)
  rect 2.1x0.95 smd: 15(9.002,-5.715) 16(9.002,-4.445) 17(9.002,-3.175) 18(9.002,-1.905) 19(9.002,-0.635) 20(9.002,0.635) 21(9.002,1.905) 22(9.002,3.175) 23(9.002,4.445) 24(9.002,5.715)
  rect 0.9x0.9 smd: 39(-2.721,-0.1) 39(-2.721,-1.5) 39(-2.721,-2.9) 39(-1.321,-0.1) 39(-1.321,-1.5) 39(-1.321,-2.9) 39(0.079,-0.1) 39(0.079,-1.5) 39(0.079,-2.9)

## Nets
As in the schematic.

Pads without a net: R16 4 5; SW1 2 4; SW2 2 4; SW3 2 4; SW4 2 4; SW5 2 4; SW6 2 4; SW7 2 4; SW8 2 4; SW9 2 4; U1 7 8 9 10 11 12; U2 4; U3 4 5 6 7 9 11 12 13 14 16 17 18 19 20 21 22 24 32 39; U5 2; USBC1 1 2 3 4 A8 B6 B7 B8

## Via types
v1: diameter 0.61, hole 0.305, Top Layer to Bottom Layer, 136 vias

## Routing (per net, layer and track width the routed paths; a pad name or vN(x,y) marks a point on that pad's centre or on a via; arc(x,y) is an arc through that point)
+3.3V: length 453.2
  Top Layer w0.254: 50.9,48.97 v1(50.14,48.21) ; 50.9,48.97 C9.2 C8.2 50.9,53.13 ; 50.9,48.97 50.9,47.45 v1(51.15,47.19) ; 97.54,89.53 97.55,89.53 97.81,89.28 ; 97.54,89.53 87.14,89.53 ; 97.54,89.53 97.79,89.28 97.81,89.28 ; 87.14,89.53 86.12,88.52 v1(86.12,87.5) ; 87.14,89.53 86.36,89.53 v1(86.11,89.28) ; 101.89,15.93 104.45,15.93 123,34.47 123,34.72 ; 101.89,15.93 101.41,15.93 100.23,17.1 R14.2 ; 101.89,15.93 R9.2 ; 112.79,88.87 111.17,87.25 110,87.25 ; 112.79,88.87 U2.2 ; 112.79,88.87 v1(112.79,88.52) ; 112.79,88.87 112.79,89.53 ; R10.2 62.5,36.85 62.5,53.97 61.48,54.99 61.23,54.99 ; R10.2 v1(65.61,31.84) ; R10.2 61.55,35.14 v1(64.85,31.84) ; 50.9,53.13 59.37,53.13 C20.1 61.23,54.99 ; 50.9,53.13 C7.2 50.9,60.94 33.17,78.67 C6.1 ; 70.63,62.1 84.34,75.82 84.34,77.09 v1(81.55,79.88) v1(81.04,80.39) ; 70.63,62.1 R3.2 ; 70.63,62.1 69.61,61.09 67.33,61.09 61.23,54.99 ; R6.2 123,37.85 123,34.72 ; 112.79,89.53 U2.2 ; 112.79,89.53 112.28,89.53 110,87.25 ; U2.2 v1(114.48,90.55) ; 141.04,35.22 139.52,35.22 139.02,34.72 123,34.72 ; 141.04,35.22 141.25,35.22 R8.2 ; 141.04,35.22 142.27,36.45 R7.2 ; 46.33,41.1 46.33,40.84 ; 46.33,41.1 50.14,44.91 v1(50.14,46.18) ; 46.33,41.1 46.33,41.86 49.12,44.65 v1(49.12,47.19) ; 46.33,40.84 46.33,40.11 R11.2 ; 46.33,40.84 46.07,41.1 29.04,41.1 R12.2 27.4,41.49 14.01,41.49 R13.2 ; v1(69.17,28.28) 74.32,23.12 R14.2 ; 110,87.25 106.43,87.25 ; R14.2 73.99,17.43 v1(73.99,19.64) ; 97.81,89.28 104.39,89.28 106.43,87.25 ; 97.81,89.28 98.06,89.03 104.16,89.03 105.93,87.25 106.43,87.25 ; v1(124.73,99.95) 124.73,107.97 U3.2 124.35,102.2 122.35,100.2 122.35,98.42 v1(120.83,96.9)
  Bottom Layer w0.254: v1(114.48,90.55) v1(120.83,96.9) ; 81.55,83.44 85.11,87 85.11,87.76 ; 81.55,83.44 v1(81.55,79.88) ; 81.55,83.44 81.55,84.72 U4.2 ; 81.55,83.44 81.04,82.93 v1(81.04,80.39) ; v1(50.14,48.21) v1(49.12,47.19) ; v1(124.73,99.95) 124.22,99.95 v1(112.79,88.52) ; 85.11,87.76 85.11,88.25 U4.2 ; 85.11,87.76 85.87,87.76 v1(86.12,87.5) ; v1(73.99,19.64) 64.85,28.79 v1(64.85,31.84) ; U4.2 v1(86.11,89.28) ; v1(51.15,47.19) v1(50.14,46.18) ; v1(65.61,31.84) v1(69.17,28.28)
+5V: length 206.7
  Top Layer w0.254: 77.77,94.7 U5.1 ; 77.77,94.7 v1(78.3,95.24) 78.3,95.69 ; 77.77,94.7 77.77,95.16 78.3,95.69 ; 102.58,98.13 v1(102.58,97.37) 98.77,97.37 ; 102.58,98.13 102.84,98.13 v1(103.09,97.88) ; 102.58,98.13 99.53,98.13 98.77,97.37 ; 102.58,98.13 102.58,98.64 119.6,115.66 119.6,125.82 ; v1(141.1,141.79) 141.1,142.05 141.59,142.54 USBC1.B4A9 ; 98.77,97.37 C1.1 84.04,94.57 ; 138.05,140.8 137.54,140.29 137.54,139.28 127.89,129.63 v1(123.57,129.63) ; 138.05,140.8 v1(138.3,140.8) ; 138.05,140.8 138.05,141.31 136.78,142.58 136.78,143.3 USBC1.A4B9 ; 84.04,94.57 v1(81.09,97.52) ; 84.04,94.57 83.02,94.57 v1(80.48,97.11) ; 116.55,92.29 119.31,89.53 C23.1 ; 116.55,92.29 v1(116.55,94.57) ; 116.55,92.29 116.04,92.8 v1(116.04,94.07) ; 115.79,130.64 v1(119.34,127.09) 119.6,126.83 119.6,125.82 ; 115.79,130.64 115.79,129.63 v1(118.84,126.58) 119.6,125.82 ; 115.79,130.64 115.79,136.06 117.47,137.75 ; U2.3 110.94,94.36 C5.1 109.03,98.73 C2.2 105.37,97.37 v1(104.87,97.37) ; 78.3,95.69 78.3,96.9 78.41,97.02 78.45,96.98 v1(78.45,95.84) 78.3,95.69 ; v1(121.12,129.88) 121.12,131.84 U1.4 121.28,129.88 v1(122.56,128.61)
  Bottom Layer w0.254: v1(81.09,97.52) 80.58,97.52 80.17,97.11 ; 104.36,97.62 102.84,97.62 v1(102.58,97.37) ; 104.36,97.62 104.61,97.62 ; 104.36,97.62 104.11,97.88 v1(103.09,97.88) ; 112.74,97.37 v1(116.04,94.07) ; 112.74,97.37 113.76,97.37 v1(116.55,94.57) ; 112.74,97.37 112.49,97.62 v1(105.63,97.62) 104.61,97.62 ; 112.74,97.37 v1(104.87,97.37) 104.61,97.62 ; v1(118.84,126.58) 121.54,126.58 122.3,127.34 122.3,128.36 v1(122.56,128.61) v1(123.57,129.63) ; v1(141.1,141.79) 140.11,140.8 v1(138.3,140.8) ; v1(78.45,95.84) 79.72,97.11 80.17,97.11 ; v1(119.34,127.09) 119.34,128.1 v1(121.12,129.88) ; 80.17,97.11 v1(78.3,95.24) ; 80.17,97.11 v1(80.48,97.11)
GND: length 736.4
  Top Layer w0.254: C19.2 10.77,31.78 SW8.3 11.47,30.63 16.54,30.63 C18.2 25.88,31.97 SW7.3 30.96,31.97 C17.2 43.41,31.59 SW6.3 47,33.74 55.01,33.74 ; 55.01,33.74 SW5.3 62.05,28.09 67.9,28.09 ; 55.01,33.74 55.01,37.49 ; 112.27,97.72 112.44,97.72 112.49,97.76 ; 112.27,97.72 108.97,101.02 C4.1 ; 112.27,97.72 112.94,97.05 ; C4.1 112.49,97.76 ; C4.1 C3.1 ; C4.1 107.27,101.27 C2.1 104.73,98.62 C21.1 100.69,94.57 C1.2 93.41,90 84.29,90 U4.1 82.55,89.89 U5.4 79.72,94.5 79.06,95.15 U5.6 ; 112.49,97.76 112.94,97.3 112.94,97.05 ; 112.49,97.76 v1(119.3,104.57) ; 112.49,97.76 v1(118.88,104.07) ; 115.22,89.97 115.22,89.46 ; 115.22,89.97 115.48,89.71 115.48,89.46 ; 115.22,89.97 115.22,94.54 C5.2 112.94,97.05 ; 115.22,89.46 115.46,89.23 ; 115.22,89.46 115.22,89 ; v1(121.93,107.96) 122.69,107.96 ; 122.69,107.96 v1(122.1,107.37) ; 122.69,107.96 U3.1 123.08,111.65 ; USBC1.B1A12 142.92,143.84 144.15,143.84 v1(144.4,143.59) ; 52.72,44.35 55.77,41.3 55.77,38.5 ; 52.72,44.35 50.81,46.27 50.81,46.52 ; 52.72,44.35 52.72,44.48 52.78,44.54 ; 117.54,131.94 117.54,132.42 ; 117.54,131.94 117.54,131.68 118.56,130.67 118.76,130.67 118.88,130.55 ; 117.54,131.94 117.47,132 ; 117.54,132.42 121.95,136.83 121.95,138.61 121.86,138.7 ; 117.54,132.42 117.54,132.6 121.86,136.92 121.86,138.7 ; 117.54,132.42 117.47,132.35 117.47,132 ; 121.86,138.7 121.6,138.95 ; SW1.3 117.41,30.22 107.68,30.22 C11.1 95.3,42.6 R16.3 89.15,42.83 89.15,43.01 ; SW1.3 v1(122.4,35.21) ; SW1.3 119.6,31.9 v1(122.14,34.44) ; 116.49,88.44 128.69,88.44 129.7,89.46 C23.2 ; 116.49,88.44 116.24,88.44 115.46,89.23 ; 116.49,88.44 115.48,89.46 ; 115.46,89.23 115.48,89.25 115.48,89.46 ; 115.46,89.23 115.22,89 ; v1(125.63,37.94) 126.65,37.94 ; 126.65,37.94 C12.1 128.13,36.92 137.93,36.92 SW2.3 141.32,40.31 141.32,47.17 141.57,47.42 143.01,47.42 151.11,39.32 151.11,38.81 ; 126.65,37.94 v1(125.95,37.24) ; 118.81,137.81 118.81,137.94 118.9,138.03 ; 118.81,137.81 U1.15 118.75,138 124.08,143.33 132.97,143.33 133.48,143.84 133.99,143.84 ; 118.81,137.81 118.9,137.9 118.9,138.03 ; 55.01,37.49 C16.2 55.77,38.5 ; 55.01,37.49 55.77,38.26 55.77,38.5 ; 55.77,38.5 55.9,38.63 55.9,41.43 52.85,44.48 ; 52.85,44.48 52.85,44.61 ; 52.85,44.48 52.78,44.54 ; 52.85,44.61 52.78,44.54 ; 52.85,44.61 C20.2 ; 50.81,46.52 48.9,48.43 ; 50.81,46.52 52.78,44.54 ; 50.81,46.52 50.81,46.55 ; 48.9,48.43 48.88,48.45 ; 48.9,48.43 C9.1 C8.1 48.9,51.94 ; 121.6,138.95 119.83,138.95 118.9,138.03 ; 121.6,138.95 121.44,139.11 119.92,139.11 118.9,138.1 118.9,138.03 ; 89.15,43.01 79.56,33.43 C15.2 70.7,29.11 68.92,29.11 67.9,28.09 ; 89.15,43.01 89.15,44.28 ; 130.54,89.53 133.26,92.25 133.26,93.77 ; 130.54,89.53 130.46,89.46 129.7,89.46 ; 130.54,89.53 C23.2 ; R2.2 116.25,78.79 116.25,79.87 ; R1.2 89.15,66.63 89.15,44.28 ; R1.2 102.64,80.12 116,80.12 116.25,79.87 ; R1.2 102.35,57.49 89.15,44.28 ; 118.88,130.55 U3.38 123.08,111.65 ; 118.88,130.55 118.37,130.55 117.47,131.44 117.47,132 ; 133.26,93.77 Q2.2 ; 133.26,93.77 133.33,93.7 133.33,92.33 130.54,89.53 ; U2.1 116.51,84.19 116.51,80.12 116.25,79.87 ; U2.1 113.46,83.42 116.25,80.63 116.25,79.87 ; U2.1 115.22,89 ; 48.9,51.94 47.77,50.81 38.11,50.81 C10.1 32.12,56.79 32.12,109.12 32.38,109.37 34.19,109.37 C6.2 ; 48.9,51.94 C7.1 ; C23.2 129.7,89.46 ; 123.08,111.65 141.07,111.65 U3.15 ; SW3.3 159.38,39.07 151.37,39.07 151.11,38.81 ; 151.11,38.81 C13.1 ; 128.69,88.44 129.7,89.46 ; SW9.3 98.9,7.25 97.66,6.01 95.88,6.01 C14.1 74.44,7.03 SW4.3 73.88,9.61 73.88,12.72 73.37,13.23 73.37,22.88 68.16,28.09 67.9,28.09 ; 133.99,143.84 135.47,143.84 USBC1.A1B12 ; 133.99,143.84 v1(133.99,143.59)
  Bottom Layer w0.254: v1(118.88,104.07) 118.88,104.91 v1(121.93,107.96) ; v1(122.14,34.44) 123.16,34.44 v1(125.95,37.24) ; v1(133.99,143.59) 134.24,143.84 144.15,143.84 v1(144.4,143.59) ; v1(119.3,104.57) v1(122.1,107.37) ; v1(125.63,37.94) 122.9,35.21 v1(122.4,35.21)
$1N14651: length 22
  Top Layer w0.254: v1(132.97,141.4) 131.7,141.4 122.56,132.26 U1.5 ; USBC1.A6 138.94,142.42 v1(138.69,142.16)
  Bottom Layer w0.254: v1(132.97,141.4) 133.22,141.15 136.53,141.15 137.54,142.16 v1(138.69,142.16)
$1N14657: length 21.2
  Top Layer w0.254: v1(137.29,140.89) 137.03,140.64 132.21,140.64 123.83,132.26 U1.6 ; v1(139.44,142.03) USBC1.A7
  Bottom Layer w0.254: v1(139.44,142.03) 138.81,141.4 137.8,141.4 v1(137.29,140.89)
$1N14664: length 101.2
  Top Layer w0.254: v1(137.95,129.12) 138.96,130.13 138.96,141.03 137.94,142.05 USBC1.A5 ; v1(111.02,83.91) 104.42,83.91 R1.1 ; v1(133.37,81.87) 131.34,83.91 v1(117.12,83.91)
  Bottom Layer w0.254: v1(133.37,81.87) 139.72,88.22 139.72,127.34 v1(137.95,129.12) ; v1(111.02,83.91) v1(117.12,83.91)
$1N14674: length 87.8
  Top Layer w0.254: v1(117.52,79.33) 131.49,79.33 v1(133.26,81.11) ; USBC1.B5 140.94,142.51 140.43,142 140.43,129.06 v1(140.88,128.61) ; R2.1 114.21,78.57 v1(113.45,79.33)
  Bottom Layer w0.254: v1(133.26,81.11) 133.52,81.11 140.88,88.48 v1(140.88,128.61) ; v1(113.45,79.33) v1(117.52,79.33)
$1N14925: length 95.9
  Top Layer w0.254: v1(123.78,118.8) 126.89,121.91 ; 126.89,121.91 U3.35 ; 126.89,121.91 126.89,121.15 v1(123.78,118.04) ; v1(120.22,130.27) 118.75,131.75 ; 118.75,131.75 118.75,131.29 121.28,128.75 v1(121.54,128.75) ; 118.75,131.75 U1.2 ; v1(122.25,120.32) 122.25,126.16 v1(121.24,127.18) ; v1(119.21,114.23) 110.06,105.08 110.06,104.32 ; 110.06,103.81 110.06,104.32 ; 110.06,104.32 v1(119.21,113.46) ; v1(118.95,117.02) 118.95,125.5 v1(117.98,126.47)
  Bottom Layer w0.254: 120.77,130.53 120.78,130.53 121.54,130.53 121.79,130.28 121.79,129.01 121.75,128.96 ; 120.77,130.53 120.47,130.53 v1(120.22,130.27) ; 120.77,130.53 121.49,130.53 121.75,130.27 121.75,128.96 ; 120.77,130.53 117.98,127.74 v1(117.98,126.47) ; 121.24,115.5 v1(123.78,118.04) ; 121.24,115.5 v1(119.21,113.46) ; 121.24,115.5 120.47,115.5 ; v1(119.21,114.23) 120.47,115.5 ; 120.47,115.5 v1(123.78,118.8) v1(122.25,120.32) ; 120.47,115.5 v1(118.95,117.02) ; v1(121.24,127.18) 121.75,127.69 121.75,128.96 ; 121.75,128.96 v1(121.54,128.75)
$1N14929: length 107.8
  Top Layer w0.254: v1(126.89,128.77) 123.25,128.77 121.98,130.04 121.98,132.76 121.47,133.27 121.03,133.27 120.02,132.26 U1.3 119.46,132.56 v1(119.46,133.02) ; 128.16,126.23 U3.34 128.16,127.5 v1(127.9,127.75) ; 128.16,126.23 128.09,126.16 128.09,120.58 v1(123.78,116.26) ; 128.16,126.23 128.16,119.88 v1(123.78,115.5) ; v1(119.21,111.69) 110.06,102.54 110.06,101.78 ; v1(115.14,133.02) 115.14,119.81 v1(118.95,116) ; 110.06,101.27 110.06,101.78 ; 110.06,101.78 v1(119.21,110.92)
  Bottom Layer w0.254: 119.97,111.69 v1(123.78,115.5) ; 119.97,111.69 v1(119.21,110.92) ; 119.97,111.69 119.59,112.07 ; 119.59,112.07 118.44,113.21 118.44,115.5 v1(118.95,116) ; 119.59,112.07 v1(123.78,116.26) ; 119.59,112.07 v1(119.21,111.69) ; v1(115.14,133.02) v1(119.46,133.02) ; v1(127.9,127.75) v1(126.89,128.77)
$1N16150: length 178.9
  Top Layer w0.254: 128.46,94.89 122.62,94.89 122.37,94.64 122.37,93.11 121.86,92.61 ; 128.46,94.89 129.19,94.89 130.13,93.95 ; 128.46,94.89 129.63,93.73 130.13,93.73 ; 40.37,51.82 41.64,51.82 v1(50.28,60.45) ; 40.37,51.82 v1(49.77,61.21) ; 40.37,51.82 C10.2 ; Q2.3 130.35,94.74 133.4,97.79 133.4,98.01 ; Q2.3 130.13,93.73 ; Q2.3 130.13,93.95 ; 130.13,93.73 130.13,93.95 ; 130.13,93.95 130.13,94.74 133.4,98.01 ; v1(117.54,92.35) 121.6,92.35 121.86,92.61 ; 121.86,92.61 118.3,92.61 v1(118.05,92.86) ; v1(50.68,62.13) 51.95,62.13 ; 51.95,62.13 v1(51.29,61.47) ; 51.95,62.13 R3.1 82.49,75.84 ; 82.49,75.84 v1(83.5,75.84) ; 82.49,75.84 83.25,76.6 v1(83.76,76.6) ; 133.4,98.01 133.44,98.05 133.44,99.18 133.4,99.21 ; 133.4,98.01 133.4,99.21 ; 133.4,99.21 Q1.2 125.62,107 U3.3
  Bottom Layer w0.254: v1(83.76,76.6) 101.79,76.6 ; 101.79,76.6 v1(117.54,92.35) v1(118.05,92.86) ; 101.79,76.6 101.03,75.84 v1(83.5,75.84) ; v1(49.77,61.21) v1(50.68,62.13) ; v1(50.28,60.45) v1(51.29,61.47)
$1N16384: length 42.2
  Top Layer w0.254: R4.1 120.55,100.07 120.55,127.5 116.74,131.31 116.74,132.84 121.28,137.38 U1.13
$1N16390: length 9.4
  Top Layer w0.254: R4.2 124.26,98.36 Q1.1
$1N16433: length 42.3
  Top Layer w0.254: v1(134.92,114.04) v1(138.99,118.11) 139.59,118.71 U3.25 ; v1(131.11,100.07) Q1.3 130.35,100.33 v1(130.86,100.83)
  Bottom Layer w0.254: 133.65,103.63 133.65,112.77 v1(134.92,114.04) v1(138.99,118.11) ; 133.65,103.63 v1(130.86,100.83) ; 133.65,103.63 133.65,102.61 v1(131.11,100.07)
$1N16439: length 47.7
  Top Layer w0.254: R5.1 120.04,95 120.04,127.26 116.23,131.07 116.23,133.1 120.02,136.88 U1.14
$1N16446: length 9.4
  Top Layer w0.254: R5.2 124.26,92.78 Q2.1
$1N17964: length 180.1
  Top Layer w0.254: SW1.1 114.68,31.24 C11.2 113.08,35.65 SW1.1 ; SW1.1 119.09,35.95 R6.1 134,50.86 ; 134,50.86 134.05,50.9 134.05,103.73 134,103.78 ; 134,50.86 134,103.78 ; 134,103.78 134,104.7 v1(131.97,106.73) ; 134,103.78 v1(131.51,106.27) ; v1(131.97,118.16) v1(131.97,118.93) U3.31
  Bottom Layer w0.254: v1(131.97,118.93) v1(131.97,118.16) v1(131.97,106.73) v1(131.51,106.27)
$1N17970: length 112
  Top Layer w0.254: C12.2 135.19,37.94 SW2.1 138.27,44.4 R7.1 140.27,101.78 143.06,104.57 143.06,124.89 140.27,127.68 130.11,127.68 129.43,127 U3.33
$1N17977: length 252.3
  Top Layer w0.254: 125.71,127.2 125.62,127.11 U3.36 125.71,126.44 125.71,127.2 ; 125.71,127.2 126.22,127.71 ; 127.14,127.87 126.38,127.87 126.22,127.71 ; 127.14,127.87 127.65,128.38 ; 127.14,127.87 126.98,127.71 126.22,127.71 ; 159.73,108.82 140.17,128.38 ; 159.73,108.82 SW3.1 ; 159.73,108.82 159.89,108.66 159.89,42.31 ; 159.73,108.82 159.73,108.82 140.18,128.38 140.17,128.38 ; 140.17,128.38 140.08,128.47 127.74,128.47 127.65,128.38 ; 140.17,128.38 127.65,128.38 ; 160.65,39.07 159.89,39.83 ; 160.65,39.07 160.65,41.55 159.89,42.31 ; 160.65,39.07 160.65,38.3 160.4,38.05 C13.2 148.29,33.22 141.25,33.22 R8.1 ; 159.89,39.83 159.73,39.98 SW3.1 ; 159.89,39.83 159.89,42.31 ; SW3.1 159.89,42.31
$1N17983: length 337.4
  Top Layer w0.254: 132.98,115.09 132.98,126.09 U3.30 ; 132.98,115.09 v1(135.02,113.06) ; 132.98,115.09 132.98,113.81 v1(134.38,112.42) ; 72.15,21.49 72.15,22.25 v1(72.65,22.76) ; 72.15,21.49 72.15,17.17 ; 72.15,21.49 v1(72.65,22) ; 72.15,17.17 R14.1 72.32,12.89 SW4.1 ; 72.15,17.17 22.11,17.17 4.58,34.7 C19.1
  Bottom Layer w0.254: v1(72.65,22) 135.02,84.36 v1(135.02,113.06) ; v1(134.38,112.42) 134.38,84.48 v1(72.65,22.76)
$1N17990: length 168.2
  Top Layer w0.254: v1(25.21,40.79) 24.7,40.79 C18.1 13.05,35.97 SW8.1 10.77,36.63 R13.1 ; U3.29 134.39,126.23 134.39,125.33 133.88,124.82 v1(133.63,124.82)
  Bottom Layer w0.254: v1(133.63,124.82) 109.24,124.82 v1(25.21,40.79)
$1N17997: length 157.7
  Top Layer w0.254: 135.31,125.12 135.31,125.88 135.57,126.14 ; 135.31,125.12 v1(135.31,124.87) ; 135.31,125.12 134.8,124.61 v1(134.55,124.61) ; 135.31,125.12 135.57,125.37 135.57,126.14 ; 135.57,126.14 U3.28 ; R12.1 26.95,39.93 SW7.1 29.23,38 C17.1 37.28,40.28 v1(42.36,40.28) v1(43.12,40.28)
  Bottom Layer w0.254: 133.79,124.1 123.64,124.1 88.84,89.31 88.84,86 v1(43.12,40.28) v1(42.36,40.28) ; 133.79,124.1 134.55,124.87 v1(135.31,124.87) ; 133.79,124.1 134.04,124.1 v1(134.55,124.61)
$1N18003: length 160
  Top Layer w0.254: v1(54.66,41.43) 52.88,39.65 52.88,38.63 ; 52.88,38.63 v1(55.17,40.92) ; 52.88,38.63 C16.1 47.13,37.62 SW6.1 44.84,39.55 R11.1 ; 135.18,123.72 134.93,123.47 v1(133.66,123.47) ; 135.18,123.72 v1(134.67,123.72) ; 135.18,123.72 136.96,125.5 136.96,126.26 U3.27
  Bottom Layer w0.254: v1(55.17,40.92) 55.17,51.33 ; 55.17,51.33 110.8,106.96 110.8,109.75 123.75,122.71 132.89,122.71 ; 55.17,51.33 54.66,50.83 v1(54.66,41.43) ; 132.89,122.71 133.66,122.71 v1(134.67,123.72) ; 132.89,122.71 v1(133.66,123.47)
$1N18034: length 180.4
  Top Layer w0.254: v1(84.19,64.92) 73.02,53.75 73.02,52.98 ; SW5.1 61.36,34.09 R10.1 ; 61.36,31.14 65.9,31.14 68.19,33.43 C15.1 73.02,52.98 ; 73.02,52.98 v1(84.19,64.16) ; v1(134.99,114.96) 138.32,118.29 U3.26 138.29,126.32 v1(138.29,118.52)
  Bottom Layer w0.254: 91.05,64.92 90.29,64.16 v1(84.19,64.16) ; 91.05,64.92 133.21,107.09 133.21,113.18 ; 91.05,64.92 v1(84.19,64.92) ; v1(138.29,118.52) 133.21,113.44 133.21,113.18 ; 133.21,113.18 v1(134.99,114.96)
$1N18049: length 141
  Top Layer w0.254: 100.68,13.9 100.68,14.69 R9.1 ; 100.68,13.9 103.73,13.9 v1(123.29,33.46) v1(123.8,33.97) ; 100.68,13.9 100.68,13.14 SW9.1 96.86,9.32 C14.2 ; U3.23 141.84,121.79 142.55,121.09 142.55,104.79 139.54,101.78 139.54,52.76 124.81,38.03 124.81,37.52 125.83,36.51 ; 125.83,36.51 126.34,36.51 v1(126.59,36.76) ; 125.83,36.51 v1(126.08,36.25)
  Bottom Layer w0.254: v1(123.29,33.46) v1(123.8,33.97) v1(126.08,36.25) v1(126.59,36.76)
$1N18923: length 102.5
  Top Layer w0.254: 124.35,123.97 v1(123.68,123.3) ; 124.35,123.97 U3.37 ; 124.35,123.97 v1(124.35,123.3)
  Bottom Layer w0.254: v1(123.68,123.3) 123.59,123.3 90.31,90.03 90.31,89.93 ; v1(123.68,123.3) v1(124.35,123.3) ; v1(123.68,123.3) 90.31,89.93 ; 90.31,89.93 90.17,89.79 U4.4 90.31,88.41 90.31,89.93
$1N18929: length 60.7
  Top Layer w0.254: 90.82,87.01 92.09,88.28 v1(93.11,88.28) ; 90.82,87.01 88.88,87.01 U4.3 ; 90.82,87.01 91.84,87.01 v1(93.11,88.28) ; 129.68,105.3 v1(128.16,105.3) ; 129.68,105.3 131.97,107.59 U3.8 ; 129.68,105.3 129.17,104.79 v1(128.67,104.79) ; v1(93.11,88.28) v1(94.63,88.28)
  Bottom Layer w0.254: v1(128.67,104.79) 127.65,104.79 ; 127.65,104.79 v1(128.16,105.3) ; 127.65,104.79 111.9,89.04 97.42,89.04 96.66,88.28 v1(94.63,88.28) v1(93.11,88.28)
$1N19540: length 186
  Top Layer w0.254: v1(130.17,109.86) v1(131.18,109.86) 133.72,109.86 134.49,109.1 134.49,108.37 U3.10 ; v1(112.13,109.1) 52.19,109.1 51.68,108.59 ; 51.68,108.59 v1(111.63,108.59) ; 51.68,108.59 R15.2
  Bottom Layer w0.254: v1(130.17,109.86) 129.41,109.1 v1(112.13,109.1) ; v1(111.63,108.59) 129.91,108.59 v1(131.18,109.86)
$1N19549: length 137.3
  Top Layer w0.254: v1(98.03,89.92) v1(98.54,90.42) C21.2 ; v1(96.25,88.9) 95.49,88.14 ; 95.49,88.14 95.49,87.88 84.82,77.22 ; 95.49,88.14 84.82,77.47 ; 95.49,88.14 v1(95.49,88.9) ; 84.82,77.22 84.82,43.06 R16.1 ; 84.82,77.22 84.82,77.47 ; 84.82,77.47 75.93,86.36 41.43,86.36 R15.1
  Bottom Layer w0.254: v1(95.49,88.9) 97.01,90.42 v1(98.54,90.42) ; v1(96.25,88.9) 97.27,89.92 v1(98.03,89.92)
$1N19616: length 94.9
  Top Layer w0.254: 119.57,71.94 117.8,71.94 v1(89.86,44) ; 119.57,71.94 v1(90.87,43.24) ; 119.57,71.94 C22.1
  Bottom Layer w0.254: R16.2 88.27,44 90.11,44 v1(90.87,43.24)
$1N19621: length 85.2
  Top Layer w0.254: 110.65,77.53 105.32,77.53 v1(103.54,79.31) ; 110.65,77.53 v1(108.87,79.31) ; 110.65,77.53 124.11,77.53 C22.2 ; v1(107.86,80.83) 106.84,80.83 v1(104.56,83.12) ; 92.11,86.42 82.71,86.42 79.06,90.07 U5.3 ; 92.11,86.42 v1(93.13,87.44) ; 92.11,86.42 92.87,86.42 v1(94.14,87.69)
  Bottom Layer w0.254: v1(108.87,79.31) 108.87,79.82 v1(107.86,80.83) ; v1(93.13,87.44) 97.44,83.12 98.71,83.12 ; v1(104.56,83.12) 98.71,83.12 ; 98.71,83.12 102.52,79.31 v1(103.54,79.31) ; 98.71,83.12 v1(94.14,87.69)
$1N19795: length 17.1
  Top Layer w0.254: U5.5 79.72,97.91 79.3,98.33 70.16,98.33 C24.1
$1N19810: length 12.7
  Top Layer w0.254: U5.8 66.75,97.02 C25.1
$1N19936: length 153.8
  Top Layer w0.254: v1(141.78,131.34) 141.78,131.85 ; 141.78,131.85 150.38,140.45 ; 141.78,131.85 141.09,131.16 v1(141.02,131.16)
  Bottom Layer w0.254: 110.03,131.41 74.47,95.85 73.46,95.85 ; 110.03,131.41 109.02,131.41 73.46,95.85 ; 110.03,131.41 140.77,131.41 ; 140.77,131.41 v1(141.02,131.16) ; 140.77,131.41 141.72,131.41 v1(141.78,131.34) ; 73.46,95.85 C25.2
$1N19941: length 89.9
  Bottom Layer w0.254: C24.2 97.59,132.37 145.76,132.37 U6.A
$1N19948: length 78.1
  Bottom Layer w0.254: 150.38,133.45 147.87,130.94 145.5,130.94 144.48,131.95 102.82,131.95 SPK1.1
$1N19955: length 73.6
  Bottom Layer w0.254: SPK1.2 111.81,130.94 140.25,130.94 140.76,130.43 149.11,130.43 151.4,132.72 151.4,136.43 150.38,137.45

## Text on the board
Bottom Silkscreen Layer: Simha's "Synthpet" Digital Trumpet
Top Silkscreen Layer: Simha's "Synthpet" Digital Trumpet | OCTAVE BUTTONS | THE NOTE YOU / ARE PLAYING WILL / DISPLAY ON THE SCREEN | THIS WILL USE TRUMPET FINGERINGS / BUT WILL PLAY IN CONCERT PITCH. / FOR EXAMPLE VALVES 1+2 and SW5 for A4 / will play CONCERT A4 at 440 HZ | START PLAYING | VALVE BUTTONS
